# Altium project DATN_Project.PrjPcb
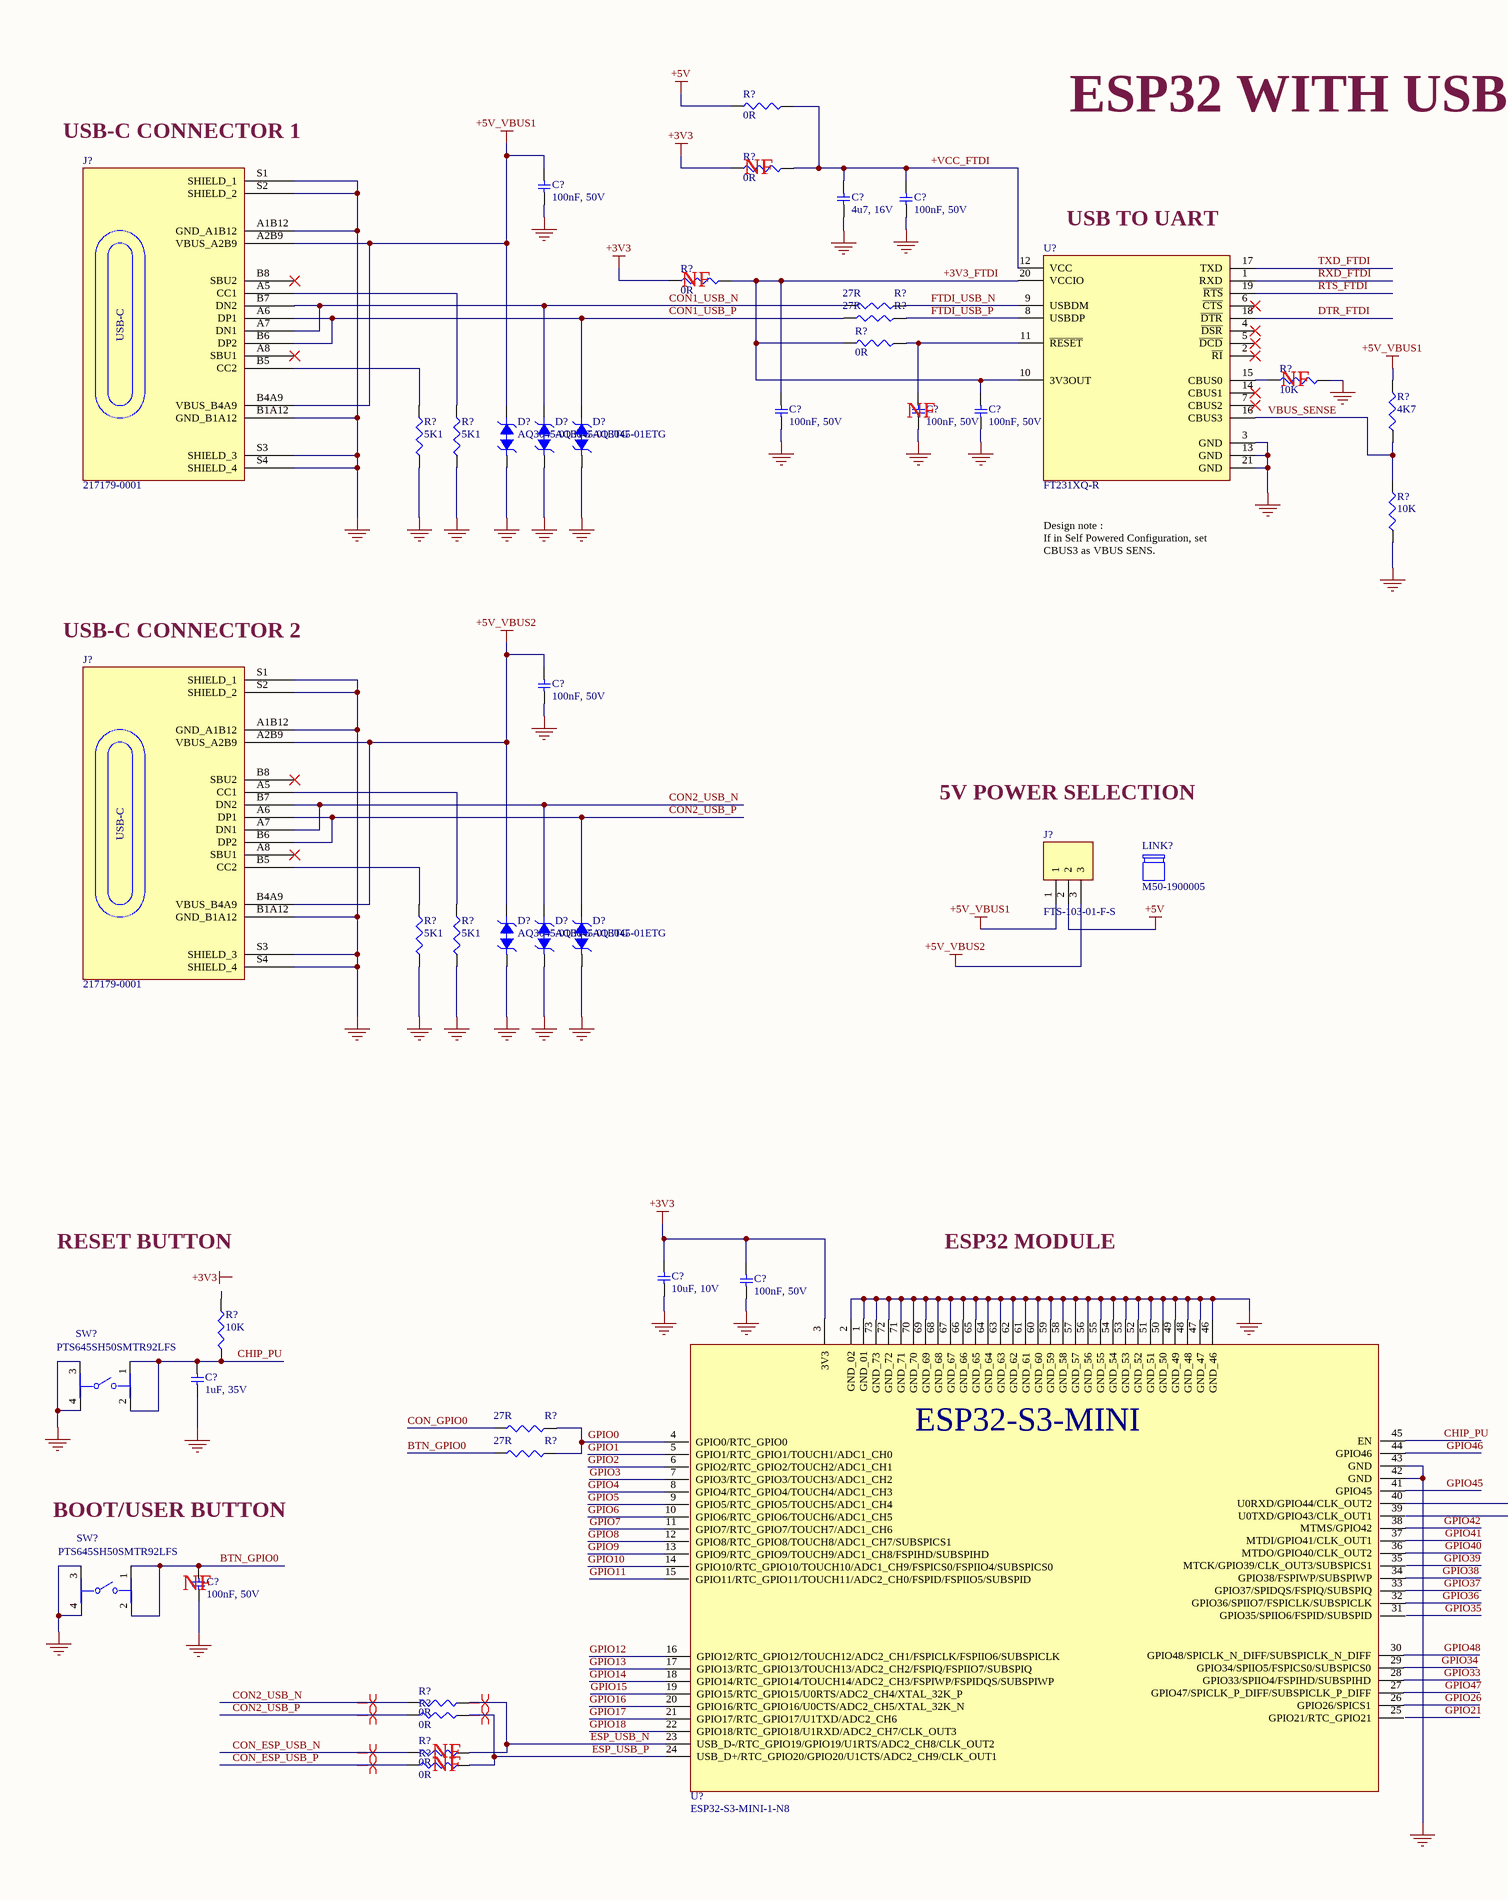
[diagram p0: ESP32.SchDoc, left]
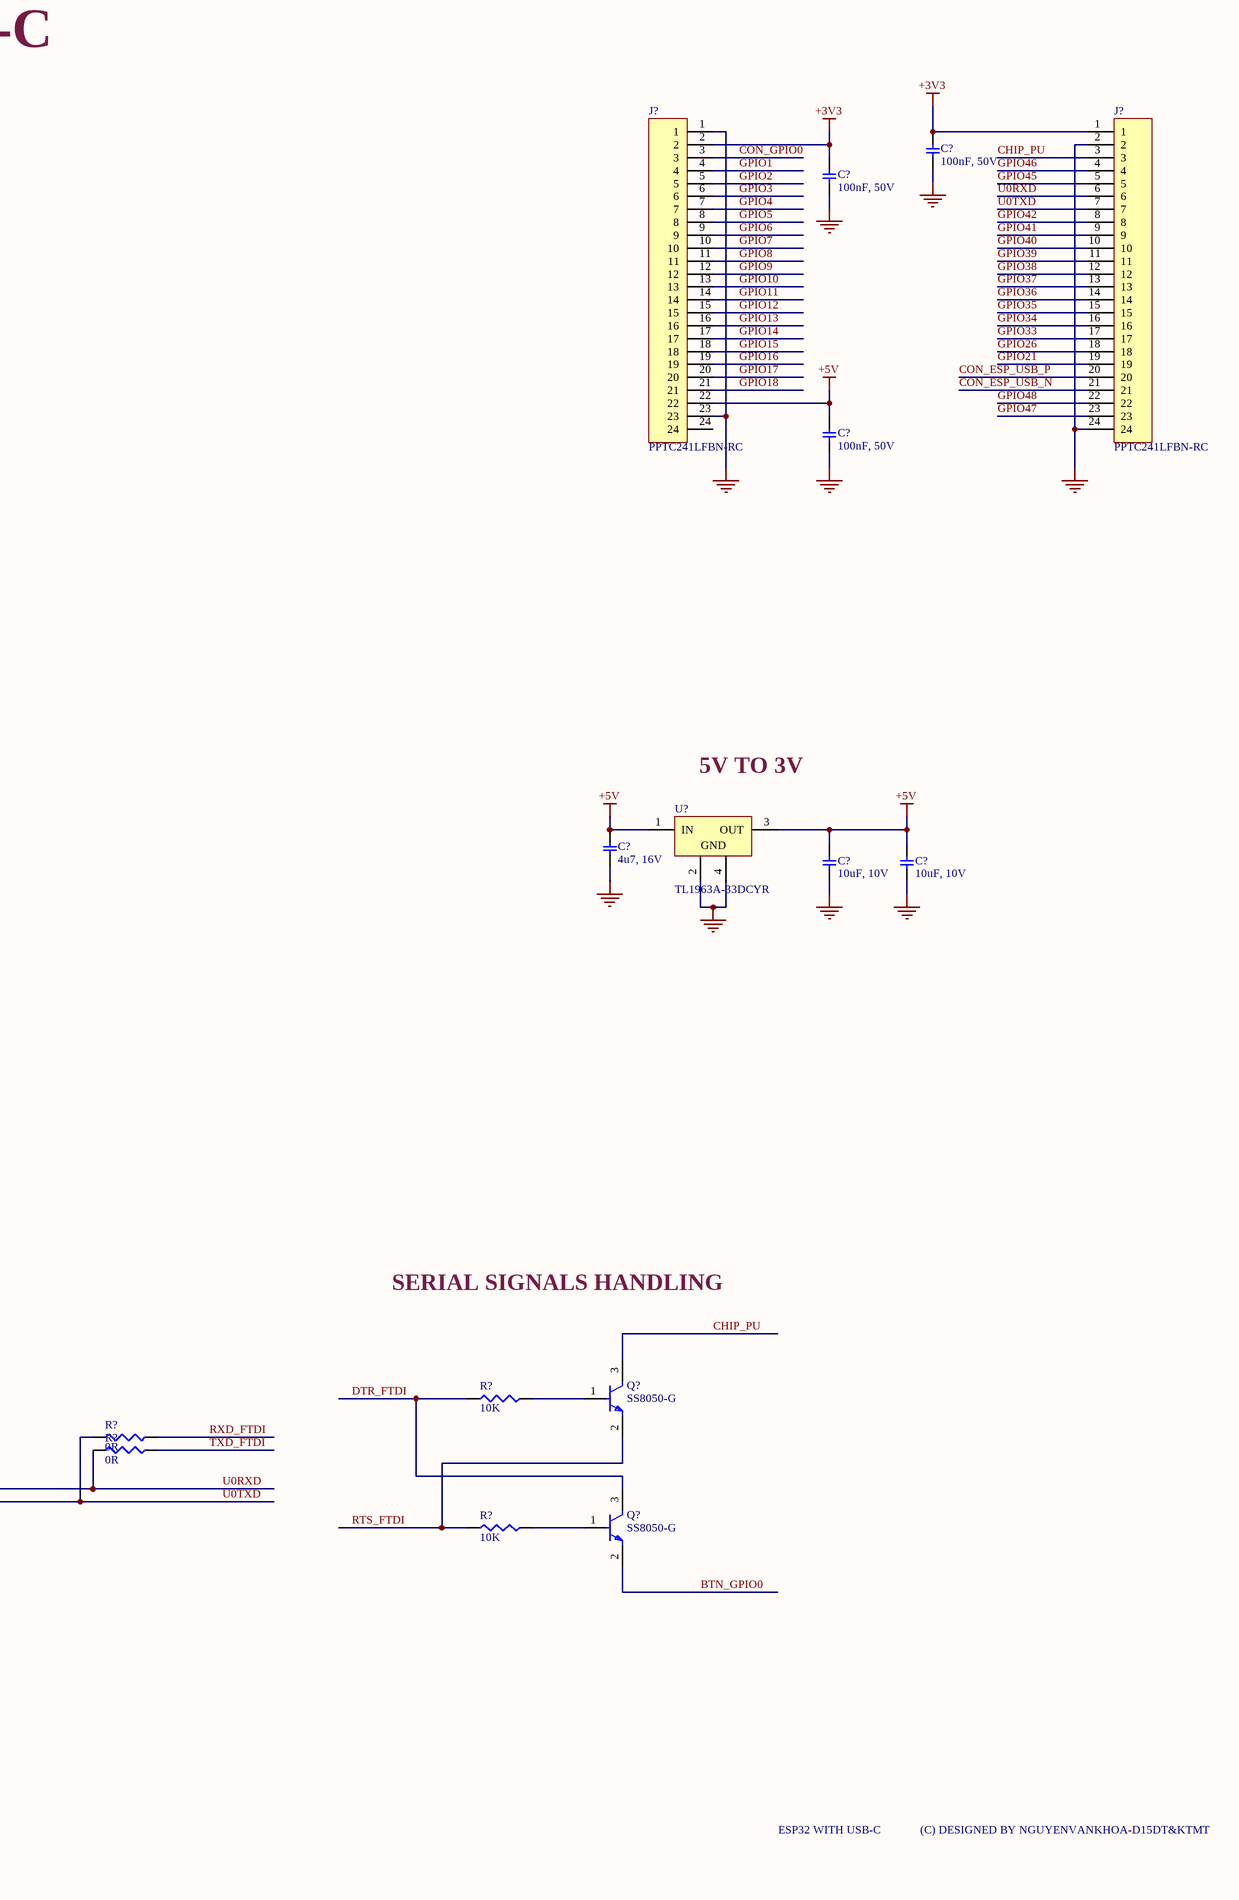
[diagram p1: ESP32.SchDoc, right]
1 sheet, 60 parts. Net scope: global (net labels, ports and power ports of the same name join across sheets).
Board file: ESP_PCB.PcbDoc

## Sheet ESP32.SchDoc
size 566 x 398 mm; Organization: ORGANIZATION; Address1: ADDRESS 1; Address2: ADDRESS 2; Address3: ADDRESS 3; Address4: ADDRESS 4; Revision: -; SheetNumber: 1; SheetTotal: 1; ENG_APP_DATE: --/--/--; DSN_APP_DATE: --/--/--; CHK_APP_DATE: --/--/--

### Parts
(Parts that share a designator on the sheet are numbered #1, #2 ... from top to bottom, then left to right.)
C?#1  4u7, 16V
C?#2  100nF, 50V
C?#3  100nF, 50V
C?#4  100nF, 50V
C?#5  100nF, 50V
C?#6  100nF, 50V
C?#7  100nF, 50V
C?#8  100nF, 50V
C?#9  100nF, 50V
C?#10  100nF, 50V
C?#11  4u7, 16V
C?#12  10uF, 10V
C?#13  10uF, 10V
C?#14  10uF, 10V
C?#15  100nF, 50V
C?#16  1uF, 35V
C?#17  100nF, 50V
D?#1  AQ3045-01ETG
D?#2  AQ3045-01ETG
D?#3  AQ3045-01ETG
D?#4  AQ3045-01ETG
D?#5  AQ3045-01ETG
D?#6  AQ3045-01ETG
J?#1  PPTC241LFBN-RC
J?#2  PPTC241LFBN-RC
J?#3  217179-0001
J?#4  217179-0001
J?#5  FTS-103-01-F-S
LINK?  M50-1900005
Q?#1  SS8050-G
Q?#2  SS8050-G
R?#1  0R
R?#2  0R
R?#3  0R
R?#4  27R
R?#5  27R
R?#6  0R
R?#7  10K
R?#8  4K7
R?#9  5K1
R?#10  5K1
R?#11  10K
R?#12  5K1
R?#13  5K1
R?#14  10K
R?#15  10K
R?#16  27R
R?#17  27R
R?#18  0R
R?#19  0R
R?#20  10K
R?#21  0R
R?#22  0R
R?#23  0R
R?#24  0R
SW?#1  PTS645SH50SMTR92LFS
SW?#2  PTS645SH50SMTR92LFS
U?#1  FT231XQ-R
U?#2  TL1963A-33DCYR
U?#3  ESP32-S3-MINI-1-N8

### Nets
+3V3: C?#4.2 C?#5.2 C?#14.2 C?#15.2 J?#1.2 J?#2.1 R?#2.1 R?#3.1 U?#3.3(3V3)
+5V: C?#9.2 C?#11.1 C?#12.2 C?#13.2 J?#1.22 J?#5.2 R?#1.1 U?#2.1(IN) U?#2.3(OUT)
+5V_VBUS1: C?#2.2 D?#2.2 J?#3.A2B9(VBUS_A2B9) J?#3.B4A9(VBUS_B4A9) J?#5.1 R?#8.2
+5V_VBUS2: C?#10.2 D?#5.2 J?#4.A2B9(VBUS_A2B9) J?#4.B4A9(VBUS_B4A9) J?#5.3
GND: C?#1.2 C?#2.1 C?#3.1 C?#4.1 C?#5.1 C?#6.1 C?#7.1 C?#8.1 C?#9.1 C?#10.1 C?#11.2 C?#12.1 C?#13.1 C?#14.1 C?#15.1 C?#16.1 C?#17.1 D?#1.1 D?#2.1 D?#3.1 D?#4.1 D?#5.1 D?#6.1 J?#1.1 J?#1.23 J?#2.2 J?#2.24 J?#3.A1B12(GND_A1B12) J?#3.B1A12(GND_B1A12) J?#3.S1(SHIELD_1) J?#3.S2(SHIELD_2) J?#3.S3(SHIELD_3) J?#3.S4(SHIELD_4) J?#4.A1B12(GND_A1B12) J?#4.B1A12(GND_B1A12) J?#4.S1(SHIELD_1) J?#4.S2(SHIELD_2) J?#4.S3(SHIELD_3) J?#4.S4(SHIELD_4) R?#7.2 R?#9.1 R?#10.1 R?#11.1 R?#12.1 R?#13.1 SW?#1.3 SW?#1.4 SW?#2.3 SW?#2.4 U?#1.3(GND) U?#1.13(GND) U?#1.21(GND) U?#2.2(GND) U?#2.4(GND) U?#3.1(GND_01) U?#3.2(GND_02) U?#3.42(GND) U?#3.43(GND) U?#3.46(GND_46) U?#3.47(GND_47) U?#3.48(GND_48) U?#3.49(GND_49) U?#3.50(GND_50) U?#3.51(GND_51) U?#3.52(GND_52) U?#3.53(GND_53) U?#3.54(GND_54) U?#3.55(GND_55) U?#3.56(GND_56) U?#3.57(GND_57) U?#3.58(GND_58) U?#3.59(GND_59) U?#3.60(GND_60) U?#3.61(GND_61) U?#3.62(GND_62) U?#3.63(GND_63) U?#3.64(GND_64) U?#3.65(GND_65) U?#3.66(GND_66) U?#3.67(GND_67) U?#3.68(GND_68) U?#3.69(GND_69) U?#3.70(GND_70) U?#3.71(GND_71) U?#3.72(GND_72) U?#3.73(GND_73)
+3V3_FTDI: C?#6.2 C?#8.2 R?#3.2 R?#6.1 U?#1.10(3V3OUT) U?#1.20(VCCIO)
+VCC_FTDI: C?#1.1 C?#3.2 R?#1.2 R?#2.2 U?#1.12(VCC)
BTN_GPIO0: C?#17.2 Q?#2.2(E) R?#17.1 SW?#2.1 SW?#2.2
CHIP_PU: C?#16.2 J?#2.3 Q?#1.3(C) R?#14.1 SW?#1.1 SW?#1.2 U?#3.45(EN)
CON1_USB_N: D?#3.2 J?#3.A7(DN1) J?#3.B7(DN2) R?#4.1
CON1_USB_P: D?#1.2 J?#3.A6(DP1) J?#3.B6(DP2) R?#5.1
CON2_USB_N: D?#6.2 J?#4.A7(DN1) J?#4.B7(DN2) R?#21.1
CON2_USB_P: D?#4.2 J?#4.A6(DP1) J?#4.B6(DP2) R?#22.1
CON_ESP_USB_N: J?#2.21 R?#23.1
CON_ESP_USB_P: J?#2.20 R?#24.1
CON_GPIO0: J?#1.3 R?#16.1
DTR_FTDI: Q?#2.3(C) R?#15.2 U?#1.18(~{DTR})
ESP_USB_N: R?#21.2 R?#23.2 U?#3.23(USB_D-/RTC_GPIO19/GPIO19/U1RTS/ADC2_CH8/CLK_OUT2)
ESP_USB_P: R?#22.2 R?#24.2 U?#3.24(USB_D+/RTC_GPIO20/GPIO20/U1CTS/ADC2_CH9/CLK_OUT1)
FTDI_USB_N: R?#4.2 U?#1.9(USBDM)
FTDI_USB_P: R?#5.2 U?#1.8(USBDP)
GPIO0: R?#16.2 R?#17.2 U?#3.4(GPIO0/RTC_GPIO0)
GPIO1: J?#1.4 U?#3.5(GPIO1/RTC_GPIO1/TOUCH1/ADC1_CH0)
GPIO2: J?#1.5 U?#3.6(GPIO2/RTC_GPIO2/TOUCH2/ADC1_CH1)
GPIO3: J?#1.6 U?#3.7(GPIO3/RTC_GPIO3/TOUCH3/ADC1_CH2)
GPIO4: J?#1.7 U?#3.8(GPIO4/RTC_GPIO4/TOUCH4/ADC1_CH3)
GPIO5: J?#1.8 U?#3.9(GPIO5/RTC_GPIO5/TOUCH5/ADC1_CH4)
GPIO6: J?#1.9 U?#3.10(GPIO6/RTC_GPIO6/TOUCH6/ADC1_CH5)
GPIO7: J?#1.10 U?#3.11(GPIO7/RTC_GPIO7/TOUCH7/ADC1_CH6)
GPIO8: J?#1.11 U?#3.12(GPIO8/RTC_GPIO8/TOUCH8/ADC1_CH7/SUBSPICS1)
GPIO9: J?#1.12 U?#3.13(GPIO9/RTC_GPIO9/TOUCH9/ADC1_CH8/FSPIHD/SUBSPIHD)
GPIO10: J?#1.13 U?#3.14(GPIO10/RTC_GPIO10/TOUCH10/ADC1_CH9/FSPICS0/FSPIIO4/SUBSPICS0)
GPIO11: J?#1.14 U?#3.15(GPIO11/RTC_GPIO11/TOUCH11/ADC2_CH0/FSPID/FSPIIO5/SUBSPID)
GPIO12: J?#1.15 U?#3.16(GPIO12/RTC_GPIO12/TOUCH12/ADC2_CH1/FSPICLK/FSPIIO6/SUBSPICLK)
GPIO13: J?#1.16 U?#3.17(GPIO13/RTC_GPIO13/TOUCH13/ADC2_CH2/FSPIQ/FSPIIO7/SUBSPIQ)
GPIO14: J?#1.17 U?#3.18(GPIO14/RTC_GPIO14/TOUCH14/ADC2_CH3/FSPIWP/FSPIDQS/SUBSPIWP)
GPIO15: J?#1.18 U?#3.19(GPIO15/RTC_GPIO15/U0RTS/ADC2_CH4/XTAL_32K_P)
GPIO16: J?#1.19 U?#3.20(GPIO16/RTC_GPIO16/U0CTS/ADC2_CH5/XTAL_32K_N)
GPIO17: J?#1.20 U?#3.21(GPIO17/RTC_GPIO17/U1TXD/ADC2_CH6)
GPIO18: J?#1.21 U?#3.22(GPIO18/RTC_GPIO18/U1RXD/ADC2_CH7/CLK_OUT3)
GPIO21: J?#2.19
GPIO26: J?#2.18 U?#3.26(GPIO26/SPICS1)
GPIO33: J?#2.17 U?#3.28(GPIO33/SPIIO4/FSPIHD/SUBSPIHD)
GPIO34: J?#2.16 U?#3.29(GPIO34/SPIIO5/FSPICS0/SUBSPICS0)
GPIO35: J?#2.15
GPIO36: J?#2.14 U?#3.32(GPIO36/SPIIO7/FSPICLK/SUBSPICLK)
GPIO37: J?#2.13 U?#3.33(GPIO37/SPIDQS/FSPIQ/SUBSPIQ)
GPIO38: J?#2.12 U?#3.34(GPIO38/FSPIWP/SUBSPIWP)
GPIO39: J?#2.11
GPIO40: J?#2.10 U?#3.36(MTDO/GPIO40/CLK_OUT2)
GPIO41: J?#2.9 U?#3.37(MTDI/GPIO41/CLK_OUT1)
GPIO42: J?#2.8 U?#3.38(MTMS/GPIO42)
GPIO45: J?#2.5 U?#3.41(GPIO45)
GPIO46: J?#2.4 U?#3.44(GPIO46)
GPIO47: J?#2.23 U?#3.27(GPIO47/SPICLK_P_DIFF/SUBSPICLK_P_DIFF)
GPIO48: J?#2.22 U?#3.30(GPIO48/SPICLK_N_DIFF/SUBSPICLK_N_DIFF)
RTS_FTDI: Q?#1.2(E) R?#20.2 U?#1.19(~{RTS})
RXD_FTDI: R?#18.2 U?#1.1(RXD)
TXD_FTDI: R?#19.2 U?#1.17(TXD)
U0RXD: J?#2.6 R?#19.1 U?#3.40(U0RXD/GPIO44/CLK_OUT2)
U0TXD: J?#2.7 R?#18.1
VBUS_SENSE: R?#8.1 R?#11.2 U?#1.16(CBUS3)
NetC?#7_2: C?#7.2 R?#6.2 U?#1.11(~{RESET})
NetJ?#3_A5: J?#3.A5(CC1) R?#10.2
NetJ?#3_B5: J?#3.B5(CC2) R?#9.2
NetJ?#4_A5: J?#4.A5(CC1) R?#13.2
NetJ?#4_B5: J?#4.B5(CC2) R?#12.2
NetQ?#1_1: Q?#1.1(B) R?#15.1
NetQ?#2_1: Q?#2.1(B) R?#20.1
NetR?#7_1: R?#7.1 U?#1.15(CBUS0)

Not connected (* = marked no-connect by the designer): J?#1 24; J?#3 A8(SBU1)* B8(SBU2)*; J?#4 A8(SBU1)* B8(SBU2)*; R?#14 2; U?#1 2(~{RI})* 4(~{DSR})* 5(~{DCD})* 6(~{CTS})* 7(CBUS2)* 14(CBUS1)*; U?#3 25(GPIO21/RTC_GPIO21) 31(GPIO35/SPIIO6/FSPID/SUBSPID) 35(MTCK/GPIO39/CLK_OUT3/SUBSPICS1) 39(U0TXD/GPIO43/CLK_OUT1)

### Layout directives
differential pair; differential pair class DIFF90: CON2_USB_N, CON2_USB_P, CON_ESP_USB_N, CON_ESP_USB_P, ESP_USB_N, ESP_USB_P

### Notes on the sheet
- ESP32 WITH USB-C
- (near J?#3) USB-C CONNECTOR 1
- (near R?#2) NF
- (near U?#1) USB TO UART
- (near R?#3) NF
- (near R?#7) NF
- (near C?#7) NF
- Design note :
  If in Self Powered Configuration, set CBUS3 as VBUS SENS.
- (near J?#4) USB-C CONNECTOR 2
- 5V POWER SELECTION
- 5V TO 3V
- RESET BUTTON
- ESP32 MODULE
- SERIAL SIGNALS HANDLING
- BOOT/USER BUTTON
- (near C?#17) NF
- (near R?#23) NF
- (C) DESIGNED BY NGUYENVANKHOA-D15DT&KTMT
- Labels drawn without touching a wire or pin: +3V3
- DWG. NO.
- REV.
- SHT.
- THIS DOCUMENT AND THE DATA DISCLOSED HEREIN OR HEREWITH IS THE PROPERTY OF ALTIUM LIMITED AND MAY BE FREELY DISTRIBUTED IN WHOLE. NO RIGHTS ARE RESERVED OR EXPRESS OR IMPLIED WARANTEE GIVEN.
- REVISION
- DESCRIPTION
- DATE
- APPROVED
- ENG:
- APPROVALS
- PROJECT
- DSN:
- CHK:
- REFERENCE DOCUMENTS
- PROJECT REVISION:
- TITLE
- DOCUMENT REVISION:
- DESIGN ITEM:
- BOM:
- FAB DWG:
- PCB DWG:
- ASSY DWG:
- SCALE:
- SIZE
- B
- CAGE CODE
- FILE NAME
- DWG NO.
- SHEET
- OF
- REV
- (in symbol 217179-0001) USB-C
- (in symbol ESP32-S3-MINI-1-N8) ESP32-S3-MINI

### Library data of the parts
C?#1 C?#11 = CL05A475MO5NUNC: CAP CER 4.7UF 16V X5R 0402; Manufacturer: Samsung; Material: 4241ConductorMaterial; Tolerance: 20%; Supplier 1: Digikey; Manufacturer Part Number: CL05A475MO5NUNC; RoHS: Yes; Category: Ceramic Capacitors; Stock 1: 242612; Pricing 1: 1=0.45, 10=0.268, 50=0.1948, 100=0.1721, 500=0.1333, 1000=0.12121, 2500=0.10837, 5000=0.10058 (USD); Mount: Surface Mount; Case/Package: 0402; Case Code (Metric): 1005; Case Code (Imperial): 0402; Min Operating Temperature: -55°C; Max Operating Temperature: 85°C; Packaging: Cut Tape; Capacitance: 4.7uF; Voltage Rating: 16V; Series: CL; Voltage Rating (DC): 16V; Length: 0.039inch; Width: 0.02inch; Height: 550um; Thickness: 0.022inch; RoHS Compliant: Yes; ComponentLink1URL: http://www.farnell.com/datasheets/2710653.pdf?src-supplier=Farnell; ComponentLink1Description: http://www.farnell.com/datasheets/2710653.pdf?src-supplier=Farnell; ComponentLink2URL: http://www.samsungsem.com/kr/support/product-search/mlcc/CL05A475MO5NUNC.jsp?src-supplier=Digikey; ComponentLink2Description: http://www.samsungsem.com/kr/support/product-search/mlcc/CL05A475MO5NUNC.jsp?src-supplier=Digikey; ComponentLink3URL: http://www.farnell.com/datasheets/2710653.pdf?src-supplier=Element14; ComponentLink3Description: http://www.farnell.com/datasheets/2710653.pdf?src-supplier=Element14; ComponentLink4URL: https://datasheet.octopart.com/CL05A475MO5NUNC-Samsung-Electro-Mechanics-datasheet-123102911.pdf?src-supplier=Future+Electronics; ComponentLink4Description: https://datasheet.octopart.com/CL05A475MO5NUNC-Samsung-Electro-Mechanics-datasheet-123102911.pdf?src-supplier=Future+Electronics; ComponentLink5URL: http://www.farnell.com/datasheets/2710653.pdf?src-supplier=Newark; ComponentLink5Description: http://www.farnell.com/datasheets/2710653.pdf?src-supplier=Newark; Supplier Part Number 1: 1276-6836-1-ND; LCSC Part Number: C318563
C?#2-C?#10 C?#15 C?#17 = CL05B104KB54PNC: CAP CER 0.1UF 50V X7R 0402; Manufacturer: Samsung; Material: 4241ConductorMaterial; Tolerance: 10%; Supplier 1: Digikey; Manufacturer Part Number: CL05B104KB54PNC; RoHS: Yes; Category: Ceramic Capacitors; Stock 1: 607949; Pricing 1: 1=0.1, 10=0.036, 50=0.0246, 100=0.0211, 500=0.01508, 1000=0.0132, 2500=0.01122, 5000=0.01002 (USD); Case/Package: 343Case; Min Operating Temperature: -55°C; Max Operating Temperature: 125°C; Voltage Rating: 50V; Capacitance: 100nF; Height: 550um; RoHS Compliant: Yes; ComponentLink1URL: https://datasheet.octopart.com/CL05B104KB54PNC-Samsung-datasheet-8326407.pdf?src-supplier=TME; ComponentLink1Description: https://datasheet.octopart.com/CL05B104KB54PNC-Samsung-datasheet-8326407.pdf?src-supplier=TME; Supplier Part Number 1: 1276-CL05B104KB54PNCCT-ND; LCSC Part Number: C307331
C?#12-C?#14 = CL05A106MP8NUB8: CAP CER 10UF 10V X5R 0402; Manufacturer: Samsung; Material: Ceramic; Tolerance: 20%; Supplier 1: Digikey; Manufacturer Part Number: CL05A106MP8NUB8; RoHS: Yes; Category: Ceramic Capacitors; Stock 1: 965097; Pricing 1: 1=0.33, 10=0.215, 50=0.1584, 100=0.129, 500=0.1018, 1000=0.08597, 2500=0.08145, 8000=0.0724, 16000=0.07013, 24000=0.06787, 56000=0.06335 (USD); Mount: Surface Mount; Case/Package: 0402; Case Code (Metric): 1005; Case Code (Imperial): 0402; Min Operating Temperature: -55°C; Max Operating Temperature: 85°C; Packaging: Cut Tape; Capacitance: 10uF; Voltage Rating: 10V; Series: CL; Length: 0.039inch; Width: 0.02inch; Height: 550um; Thickness: 0.035inch; RoHS Compliant: Yes; ComponentLink1URL: http://www.samsungsem.com/kr/support/product-search/mlcc/CL05A106MP8NUB8.jsp?src-supplier=Digikey; ComponentLink1Description: http://www.samsungsem.com/kr/support/product-search/mlcc/CL05A106MP8NUB8.jsp?src-supplier=Digikey; ComponentLink2URL: https://datasheet.octopart.com/CL05A106MP8NUB8-Samsung-Electro-Mechanics-datasheet-136460857.pdf?src-supplier=Future+Electronics; ComponentLink2Description: https://datasheet.octopart.com/CL05A106MP8NUB8-Samsung-Electro-Mechanics-datasheet-136460857.pdf?src-supplier=Future+Electronics; Supplier Part Number 1: 1276-6830-1-ND; LCSC Part Number: C307415
C?#16 = CL05A105KL5NRNC: CAP CER 1UF 35V X5R 0402; Manufacturer: Samsung; Tolerance: 10%; Supplier 1: Digikey; Manufacturer Part Number: CL05A105KL5NRNC; RoHS: Yes; Category: Ceramic Capacitors; Stock 1: 314483; Pricing 1: 1=0.33, 10=0.212, 50=0.149, 100=0.1202, 500=0.08934, 1000=0.07818, 2500=0.07446, 5000=0.06887 (USD); Mount: Surface Mount; Case/Package: 0402; Case Code (Metric): 1005; Case Code (Imperial): 0402; Min Operating Temperature: -55°C; Max Operating Temperature: 85°C; Packaging: Cut Tape; Capacitance: 1uF; Voltage Rating: 35V; Series: CL; Length: 0.039inch; Width: 0.02inch; Thickness: 0.022inch; RoHS Compliant: Yes; ComponentLink1URL: http://www.samsungsem.com/kr/support/product-search/mlcc/CL05A105KL5NRNC.jsp?src-supplier=Digikey; ComponentLink1Description: http://www.samsungsem.com/kr/support/product-search/mlcc/CL05A105KL5NRNC.jsp?src-supplier=Digikey; Supplier Part Number 1: 1276-6796-1-ND; LCSC Part Number: C307413
D?#1-D?#6 = AQ3045-01ETG: TVS DIODE 5.3VWM 12VC SOD882; Manufacturer: Littelfuse; Number of Bidirectional Channels: 1; Reverse Standoff Voltage: 5.3V; Min Breakdown Voltage: 6.8V; Peak Pulse Current: 3A; Peak Pulse Power: 40W; Power Line Protection: No; Diode Type: ZENER; Leakage Current: 100nA; Supplier 1: Digikey; Manufacturer Part Number: AQ3045-01ETG; RoHS: Yes; Category: TVS Diodes; Stock 1: 11003; Pricing 1: 1=0.5, 10=0.391, 100=0.2344, 500=0.217, 1000=0.14756, 2000=0.13585, 5000=0.1302 (USD); Mount: Surface Mount; Min Operating Temperature: -55°C; Max Operating Temperature: 150°C; Packaging: Cut Tape; Series: Automotive, AEC-Q101, AQ3045, SPA®; Number of Channels: 1; Operating Supply Voltage: 5.3V; RoHS Compliant: Yes; ComponentLink1URL: http://www.littelfuse.com/~/media/electronics/datasheets/tvs_diode_arrays/littelfuse_tvs_diode_array_aq3045_datasheet.pdf.pdf?src-supplier=Digikey; ComponentLink1Description: http://www.littelfuse.com/~/media/electronics/datasheets/tvs_diode_arrays/littelfuse_tvs_diode_array_aq3045_datasheet.pdf.pdf?src-supplier=Digikey; ComponentLink2URL: https://www.littelfuse.com/~/media/electronics/datasheets/tvs_diode_arrays/littelfuse_tvs_diode_array_aq3045_datasheet.pdf.pdf?src-supplier=Digikey; ComponentLink2Description: https://www.littelfuse.com/~/media/electronics/datasheets/tvs_diode_arrays/littelfuse_tvs_diode_array_aq3045_datasheet.pdf.pdf?src-supplier=Digikey; ComponentLink3URL: https://datasheet.octopart.com/AQ3045-01ETG-Littelfuse-datasheet-101609968.pdf?src-supplier=Farnell; ComponentLink3Description: https://datasheet.octopart.com/AQ3045-01ETG-Littelfuse-datasheet-101609968.pdf?src-supplier=Farnell; ComponentLink4URL: https://datasheet.octopart.com/AQ3045-01ETG-Littelfuse-datasheet-140480283.pdf?src-supplier=Future+Electronics; ComponentLink4Description: https://datasheet.octopart.com/AQ3045-01ETG-Littelfuse-datasheet-140480283.pdf?src-supplier=Future+Electronics; Supplier Part Number 1: F9321CT-ND; LCSC Part Number: C3710326
J?#1 J?#2 = PPTC241LFBN-RC: CONN HDR 24POS 0.1 TIN PCB; Manufacturer: Sullins; Number of Positions: 24; Connector Type: Header; Voltage Rating: 250V; Supplier 1: Digikey; Manufacturer Part Number: PPTC241LFBN-RC; RoHS: Yes; Category: Connectors; Stock 1: 10961; Pricing 1: 1=1.39, 10=1.206, 80=1.07775, 440=0.89816, 1000=0.76986, 5000=0.7332 (USD); Mount: Through Hole; Contact Material: Bronze; Housing Material: Plastic; Contact Finish - Mating: TIN; Insulation Color: Black; Insulation Material: Polyester; Contact Shape: Square; Min Operating Temperature: -40°C; Max Operating Temperature: 105°C; Number of Rows: 1; Packaging: Tray; Termination: Solder; Contact Type: Female Socket; Series: -; Fastening Type: Pull; Length: 61.5mm; Width: 2.5mm; Height: 8.5mm; Lead Free: Lead Free; RoHS Compliant: Yes; Flammability Rating: UL94 V-0; ComponentLink1URL: https://drawings-pdf.s3.amazonaws.com/10492.pdf?src-supplier=Digikey; ComponentLink1Description: https://drawings-pdf.s3.amazonaws.com/10492.pdf?src-supplier=Digikey; ComponentLink2URL: https://datasheet.octopart.com/PPTC241LFBN-RC-Sullins-datasheet-145015166.pdf?src-supplier=Future+Electronics; ComponentLink2Description: https://datasheet.octopart.com/PPTC241LFBN-RC-Sullins-datasheet-145015166.pdf?src-supplier=Future+Electronics; Supplier Part Number 1: S7022-ND; LCSC Part Number: C7328152
J?#3 J?#4 = 217179-0001: CONN RCP USB2.0 TYP C 24P SMD RA; Manufacturer: Molex; USB Standard: 6108USBStandard; Current Rating: 1.25A; Gender: 4472Gender; Number of Contacts: 16NUMBER; Voltage Rating: 30V; Supplier 1: Digikey; Manufacturer Part Number: 217179-0001; RoHS: No; Category: USB Connectors; Pricing 1: 1=0.9, 10=0.745, 100=0.6212 (USD); Contact Material: 153,157ConductorMaterial; Min Operating Temperature: -40°C; Max Operating Temperature: 85°C; Height: 3.36mm; Supplier Part Number 1: 900-2171790001CT-ND; LCSC Part Number: C3197684
J?#5 = FTS-103-01-F-S: CONN HEADER VERT 3POS 1.27MM; Manufacturer: Samtec; Number of Contacts: 3; Gender: Male; Supplier 1: Digikey; Manufacturer Part Number: FTS-103-01-F-S; RoHS: Yes; Category: Connectors; Stock 1: 3030; Pricing 1: 1=0.73, 50=0.6378, 100=0.5407, 500=0.4491, 1000=0.4 (USD); Mount: Through Hole; Contact Plating: Gold; Number of Rows: 1; Packaging: Bulk; Termination: Solder; Pitch: 1.27mm; Radiation Hardening: No; RoHS Compliant: Yes; ComponentLink1URL: http://suddendocs.samtec.com/prints/fts-1xx-xx-xx-xx-xx-mkt.pdf?src-supplier=Digikey; ComponentLink1Description: http://suddendocs.samtec.com/prints/fts-1xx-xx-xx-xx-xx-mkt.pdf?src-supplier=Digikey; ComponentLink2URL: http://www.samtec.com/documents/webfiles/pdf/FTS.pdf?src-supplier=Avnet; ComponentLink2Description: http://www.samtec.com/documents/webfiles/pdf/FTS.pdf?src-supplier=Avnet; ComponentLink3URL: https://datasheet.octopart.com/FTS-103-01-F-S-Samtec-datasheet-176663378.pdf?src-supplier=Toby+Electronics; ComponentLink3Description: https://datasheet.octopart.com/FTS-103-01-F-S-Samtec-datasheet-176663378.pdf?src-supplier=Toby+Electronics; ComponentLink4URL: https://datasheet.octopart.com/FTS-103-01-F-S-Samtec-datasheet-151470456.pdf?src-supplier=Sager+Electronics; ComponentLink4Description: https://datasheet.octopart.com/FTS-103-01-F-S-Samtec-datasheet-151470456.pdf?src-supplier=Sager+Electronics; Supplier Part Number 1: 612-FTS-103-01-F-S-ND; LCSC Part Number: C3333578
LINK? = M50-1900005: CONN SHUNT 1.27MM BLACK; Manufacturer: Harwin; Number of Positions: 2; Number of Contacts: 3; Current Rating: 1A; Voltage Rating: 500V; Insulation Resistance: 1R; Supplier 1: Digikey; Manufacturer Part Number: M50-1900005; RoHS: Yes; Category: Headers and Wire Housings; Stock 1: 33850; Pricing 1: 1=0.43, 10=0.363, 25=0.3196, 50=0.2936, 100=0.2821, 250=0.25332, 500=0.2418, 1000=0.2015, 3000=0.18422 (USD); Contact Material: Copper Alloy; Contact Plating: Gold; Color: Black; Housing Material: PBT; Housing Color: Black; Min Operating Temperature: -40°C; Max Operating Temperature: 105°C; Number of Rows: 1; Packaging: Bulk; Series: Archer M50; Package Quantity: 1000; Pitch: 1.27mm; Radiation Hardening: No; RoHS Compliant: Yes; Reach SVHC Compliant: No; Flammability Rating: UL94 V-0; ComponentLink1URL: https://datasheet.ciiva.com/767/m50-19x-767925.pdf?src-supplier=Digikey; ComponentLink1Description: https://datasheet.ciiva.com/767/m50-19x-767925.pdf?src-supplier=Digikey; ComponentLink2URL: https://datasheet.ciiva.com/1412/1836978-1412124.pdf?src-supplier=Element14; ComponentLink2Description: https://datasheet.ciiva.com/1412/1836978-1412124.pdf?src-supplier=Element14; Supplier Part Number 1: 952-1730-ND; LCSC Part Number: C6293276
Q?#1 Q?#2 = SS8050-G: TRANS NPN 25V 1.5A SOT23-3; Manufacturer: Comchip; Max Power Dissipation: 300mW; Transition Frequency: 100MHz; Collector-emitter Voltage-Max: 400mV; Collector Base Voltage (VCBO): 40V; Collector Emitter Saturation Voltage: 500mV; Emitter Base Voltage (VEBO): 5V; hFE Min: 200; Number of Elements: 1; Supplier 1: Digikey; Manufacturer Part Number: SS8050-G; RoHS: Yes; Category: Transistors; Stock 1: 90298; Pricing 1: 1=0.29, 10=0.2, 100=0.0978, 500=0.08154, 1000=0.05666 (USD); Mount: Surface Mount; Case/Package: TO-236-3; Max Operating Temperature: 150°C; Packaging: Cut Tape; Max Collector Current: 1.5A; Collector Emitter Breakdown Voltage: 25V; Max Breakdown Voltage: 25V; Series: -; Power Dissipation: 300mW; Height: 1.15mm; RoHS Compliant: Yes; ComponentLink1URL: http://www.comchiptech.com/admin/files/product/SS8050-G RevA181526.pdf?src-supplier=Digikey; ComponentLink1Description: http://www.comchiptech.com/admin/files/product/SS8050-G RevA181526.pdf?src-supplier=Digikey; Supplier Part Number 1: 641-1790-1-ND; LCSC Part Number: C164886
R?#1-R?#3 R?#6 R?#18 R?#19 R?#21-R?#24 = RC0402JR-070RL: RES 0 OHM JUMPER 1/16W 0402; Manufacturer: Yageo; Resistance: 0mR; Power Rating: 62.5mW; Tolerance: 5%; Voltage Rating: 50V; Max Power Dissipation: 63mW; Temperature Coefficient: 200ppm/°C; Supplier 1: Digikey; Manufacturer Part Number: RC0402JR-070RL; RoHS: Yes; Category: Chip SMD Resistors; Stock 1: 14519977; Pricing 1: 1=0.1, 10=0.011, 25=0.0084, 50=0.0064, 100=0.0045, 250=0.00364, 500=0.0029, 1000=0.00214, 5000=0.00154, 10000=0.00133, 30000=0.00117, 50000=0.00107, 100000=0.00105 (USD); Case/Package: 0402; Contact Plating: Tin,Matte; Case Code (Metric): 1005; Case Code (Imperial): 0402; Size Code: 0402; Min Operating Temperature: -55°C; Max Operating Temperature: 155°C; Packaging: Tape and Reel; Resistor Type: Thick Film; Package Quantity: 1; Number of Terminations: 2; Termination: SMD/SMT; Features: Moisture Resistant; Series: RC; Technology: THICK FILM; Resistance Tolerance: 5%; Construction: Rectangular; Length: 1mm; Width: 0.02inch; Height: 0.016inch; Depth: 0.5mm; Reach SVHC Compliant: Unknown; Lead Free: 5697LeadFree; Military Standard: Not; RoHS Compliant: Yes; Supplier Part Number 1: 311-0.0JRCT-ND; LCSC Part Number: C60485
R?#4 R?#5 R?#16 R?#17 = RC0402FR-0727RL: RES 27 OHM 1% 1/16W 0402; Manufacturer: Yageo; Power Rating: 62.5mW; Voltage Rating: 50V; Temperature Coefficient: 100ppm/°C; Max Power Dissipation: 63mW; Supplier 1: Digikey; Manufacturer Part Number: RC0402FR-0727RL; RoHS: Yes; Category: Chip SMD Resistors; Stock 1: 217548; Pricing 1: 1=0.1, 10=0.015, 50=0.0088, 100=0.0073, 500=0.00488, 1000=0.00417, 5000=0.00297 (USD); Case/Package: 0402; Case Code (Imperial): 0402; Case Code (Metric): 1005; Weight: 2.3E-05oz; Size Code: 0402; Min Operating Temperature: -55°C; Max Operating Temperature: 155°C; Resistance: 27R; Tolerance: 1%; Packaging: Tape and Reel; Resistor Type: Thick Film; Termination: SMD/SMT; Number of Terminations: 2; Features: Moisture Resistant; Series: RC; Construction: Rectangular; Technology: THICK FILM; Resistance Tolerance: 1%; Voltage Rating (AC): 50V; Length: 1mm; Width: 0.5mm; Height: 0.016inch; Depth: 0.5mm; Military Standard: Not; Lead Free: Lead Free; RoHS Compliant: Yes; Reach SVHC Compliant: Unknown; ComponentLink1URL: https://datasheet.ciiva.com/11808/0900766b80c66297-11808450.pdf?src-supplier=Rs; ComponentLink1Description: https://datasheet.ciiva.com/11808/0900766b80c66297-11808450.pdf?src-supplier=Rs; ComponentLink2URL: https://datasheet.ciiva.com/17044/pyu-rc0402-51-rohs-l-6-17044345.pdf?src-supplier=Future+Electronics; ComponentLink2Description: https://datasheet.ciiva.com/17044/pyu-rc0402-51-rohs-l-6-17044345.pdf?src-supplier=Future+Electronics; ComponentLink3URL: https://datasheet.ciiva.com/15189/getdatasheetpartid-327852-15189402.pdf?src-supplier=Verical; ComponentLink3Description: https://datasheet.ciiva.com/15189/getdatasheetpartid-327852-15189402.pdf?src-supplier=Verical; ComponentLink4URL: https://datasheet.ciiva.com/7849/1018594-7849926.pdf?src-supplier=Element14; ComponentLink4Description: https://datasheet.ciiva.com/7849/1018594-7849926.pdf?src-supplier=Element14; ComponentLink5URL: https://datasheet.ciiva.com/7849/1018594-7849927.pdf?src-supplier=Element14; ComponentLink5Description: https://datasheet.ciiva.com/7849/1018594-7849927.pdf?src-supplier=Element14; Supplier Part Number 1: YAG3086CT-ND; LCSC Part Number: C138021
R?#7 R?#11 R?#14 R?#15 R?#20 = AC0402FR-0710KL: RES SMD 10K OHM 1% 1/16W 0402; Manufacturer: Yageo; Resistance: 10kR; Power Rating: 62.5mW; Voltage Rating: 50V; Temperature Coefficient: 100ppm/°C; Max Power Dissipation: 63mW; Supplier 1: Digikey; Manufacturer Part Number: AC0402FR-0710KL; RoHS: Yes; Category: Chip SMD Resistors; Stock 1: 2351184; Pricing 1: 1=0.1, 10=0.019, 50=0.0116, 100=0.0095, 500=0.00638, 1000=0.00544, 5000=0.00391 (USD); Case/Package: 0402; Case Code (Imperial): 0402; Case Code (Metric): 1005; Size Code: 0402; Min Operating Temperature: -55°C; Max Operating Temperature: 155°C; Tolerance: 1%; Packaging: Tape and Reel; Termination: SMD/SMT; Number of Terminations: 2; Features: Moisture Resistant,Automotive AEC-Q200; Series: AC; Length: 0.039inch; Width: 0.02inch; Height: 0.015inch; Lead Free: Lead Free; RoHS Compliant: Yes; ComponentLink1URL: https://datasheet.ciiva.com/12656/pyu-ac-51-rohs-l-2-12656634.pdf?src-supplier=Mouser; ComponentLink1Description: https://datasheet.ciiva.com/12656/pyu-ac-51-rohs-l-2-12656634.pdf?src-supplier=Mouser; Supplier Part Number 1: YAG3436DKR-ND; LCSC Part Number: C144807
R?#8 = RC0402FR-074K7L: RES 4.7K OHM 1% 1/16W 0402; Manufacturer: Yageo; Voltage Rating (DC): 50V; Power Rating: 62.5mW; Resistance: 4.7kR; Temperature Coefficient: 100ppm/°C; Max Power Dissipation: 63mW; Supplier 1: Digikey; Manufacturer Part Number: RC0402FR-074K7L; RoHS: Yes; Category: Chip SMD Resistors; Stock 1: 4963511; Pricing 1: 1=0.1, 10=0.015, 50=0.0088, 100=0.0073, 500=0.00488, 1000=0.00417, 5000=0.00297, 10000=0.00261, 20000=0.00231, 30000=0.00216, 50000=0.00199, 100000=0.00179 (USD); Case/Package: 0402; Number of Pins: 2; Case Code (Imperial): 0402; Case Code (Metric): 1005; Size Code: 0402; Min Operating Temperature: -55°C; Max Operating Temperature: 155°C; Tolerance: 1%; Voltage Rating: 50V; Packaging: Tape and Reel; Resistor Type: Thick Film; Termination: SMD/SMT; Features: Moisture Resistant; Series: RC; Number of Terminations: 2; Resistance Tolerance: 1%; Construction: Rectangular; Voltage Rating (AC): 50V; Length: 1mm; Width: 0.5mm; Depth: 0.5mm; Reach SVHC Compliant: No; Military Standard: Not; Lead Free: Lead Free; RoHS Compliant: Yes; ComponentLink1URL: https://datasheet.ciiva.com/22661/1686128-22661342.pdf?src-supplier=Element14; ComponentLink1Description: https://datasheet.ciiva.com/22661/1686128-22661342.pdf?src-supplier=Element14; ComponentLink2URL: https://datasheet.ciiva.com/7850/1018594-7850022.pdf?src-supplier=Element14; ComponentLink2Description: https://datasheet.ciiva.com/7850/1018594-7850022.pdf?src-supplier=Element14; ComponentLink3URL: https://datasheet.ciiva.com/7850/1018594-7850023.pdf?src-supplier=Element14; ComponentLink3Description: https://datasheet.ciiva.com/7850/1018594-7850023.pdf?src-supplier=Element14; ComponentLink4URL: https://datasheet.ciiva.com/15215/getdatasheetpartid-328119-15215035.pdf?src-supplier=Verical; ComponentLink4Description: https://datasheet.ciiva.com/15215/getdatasheetpartid-328119-15215035.pdf?src-supplier=Verical; Supplier Part Number 1: 311-4.7KLRCT-ND; LCSC Part Number: C105871
R?#9 R?#10 R?#12 R?#13 = AC0402FR-075K1L: RES SMD 5.1K OHM 1% 1/16W 0402; Manufacturer: Yageo; Resistance: 5.1kR; Power Rating: 63mW; Temperature Coefficient: 100ppm/°C; Voltage Rating: 50V; Supplier 1: Digikey; Manufacturer Part Number: AC0402FR-075K1L; RoHS: Yes; Category: Chip SMD Resistors; Stock 1: 83902; Pricing 1: 1=0.1, 10=0.019, 50=0.0116, 100=0.0095, 500=0.00638, 1000=0.00544, 5000=0.00391 (USD); Mount: Surface Mount; Case/Package: 0402; Case Code (Metric): 1005; Case Code (Imperial): 0402; Size Code: 0402; Min Operating Temperature: -55°C; Max Operating Temperature: 155°C; Tolerance: 1%; Packaging: Cut Tape; Number of Terminations: 2; Max Power Dissipation: 63mW; Features: Moisture Resistant,Automotive AEC-Q200; Series: AC; Length: 0.039inch; Width: 0.02inch; Height: 0.015inch; Lead Free: Lead Free; RoHS Compliant: Yes; ComponentLink1URL: http://www.yageo.com/NewPortal/yageodocoutput?fileName=/pdf/R-Chip/PYu-AC_51_RoHS_L_6.pdf&src-supplier=Digikey; ComponentLink1Description: http://www.yageo.com/NewPortal/yageodocoutput?fileName=/pdf/R-Chip/PYu-AC_51_RoHS_L_6.pdf&src-supplier=Digikey; ComponentLink2URL: http://www.yageo.com/documents/recent/PYu-AC_51_RoHS_L_2_revised.pdf?src-supplier=Future+Electronics; ComponentLink2Description: http://www.yageo.com/documents/recent/PYu-AC_51_RoHS_L_2_revised.pdf?src-supplier=Future+Electronics; ComponentLink3URL: https://datasheet.octopart.com/AC0402FR-075K1L-Yageo-datasheet-166720450.pdf?src-supplier=Future+Electronics; ComponentLink3Description: https://datasheet.octopart.com/AC0402FR-075K1L-Yageo-datasheet-166720450.pdf?src-supplier=Future+Electronics; Supplier Part Number 1: YAG3503CT-ND; LCSC Part Number: C144745
SW?#1 SW?#2 = PTS645SH50SMTR92LFS: SWITCH TACTILE SPST-NO 0.05A 12V; Manufacturer: ITT C&K; Contact Current Rating: 50mA; Contact Resistance: 100mR; Number of Positions: 2NUMBER; Supplier 1: Digikey; Manufacturer Part Number: PTS645SH50SMTR92LFS; RoHS: Yes; Category: Tactile Switches; Stock 1: 49323; Pricing 1: 1=0.35, 10=0.337, 25=0.3172, 100=0.2753, 250=0.24972, 500=0.2323 (USD); Lead Free: 5697LeadFree; ComponentLink1URL: https://datasheet.ciiva.com/29903/getdatasheetpartid-773702-29903807.pdf?src-supplier=Verical; ComponentLink1Description: https://datasheet.ciiva.com/29903/getdatasheetpartid-773702-29903807.pdf?src-supplier=Verical; ComponentLink2URL: https://datasheet.ciiva.com/14920/pts645-14920741.pdf?src-supplier=Digikey; ComponentLink2Description: https://datasheet.ciiva.com/14920/pts645-14920741.pdf?src-supplier=Digikey; ComponentLink3URL: https://datasheet.ciiva.com/22637/1707731-22637356.pdf?src-supplier=Element14; ComponentLink3Description: https://datasheet.ciiva.com/22637/1707731-22637356.pdf?src-supplier=Element14; Supplier Part Number 1: CKN9085CT-ND; LCSC Part Number: C221869
U?#1 = FT231XQ-R: IC USB SERIAL FULL UART 20QFN; Manufacturer: FTDI; Supplier 1: Digikey; Manufacturer Part Number: FT231XQ-R; RoHS: Yes; Category: Interface ICs; Stock 1: 67655; Pricing 1: 1=2.34, 25=2.27, 100=2.2, 250=2, 500=1.82002, 1000=1.7625, 5000=1.7625 (USD); Height: 800um; Lead Free: 5697LeadFree; ComponentLink1URL: https://datasheet.ciiva.com/4787/ds-ft231x-13571-4787570.pdf?src-supplier=Mouser; ComponentLink1Description: https://datasheet.ciiva.com/4787/ds-ft231x-13571-4787570.pdf?src-supplier=Mouser; ComponentLink2URL: https://datasheet.ciiva.com/30475/0900766b811020d3-30475405.pdf?src-supplier=Rs; ComponentLink2Description: https://datasheet.ciiva.com/30475/0900766b811020d3-30475405.pdf?src-supplier=Rs; ComponentLink3URL: https://datasheet.ciiva.com/1787/ds-ft231x-1787312.pdf?src-supplier=Digikey; ComponentLink3Description: https://datasheet.ciiva.com/1787/ds-ft231x-1787312.pdf?src-supplier=Digikey; ComponentLink4URL: https://datasheet.ciiva.com/1787/ft-x-series-1787313.pdf?src-supplier=Digikey; ComponentLink4Description: https://datasheet.ciiva.com/1787/ft-x-series-1787313.pdf?src-supplier=Digikey; ComponentLink5URL: https://datasheet.ciiva.com/1787/ft-x-series-1787314.pdf?src-supplier=Digikey; ComponentLink5Description: https://datasheet.ciiva.com/1787/ft-x-series-1787314.pdf?src-supplier=Digikey; Supplier Part Number 1: 768-1128-1-ND; LCSC Part Number: C132159
U?#2 = TL1963A-33DCYR: IC REG LINEAR 3.3V 1.5A SOT223-4; Manufacturer: Texas Instruments; Supplier 1: Digikey; Manufacturer Part Number: TL1963A-33DCYR; RoHS: Yes; Category: Voltage Regulators - Linear; Stock 1: 2796; Pricing 1: 1=2.87, 10=2.578, 25=2.4368, 100=2.112, 250=2.00368, 500=1.79788, 1000=1.51629 (USD); Thickness: 1.6mm; Lead Free: 5697LeadFree; ComponentLink1URL: https://datasheet.ciiva.com/2046/-2046068.pdf?src-supplier=Digikey; ComponentLink1Description: https://datasheet.ciiva.com/2046/-2046068.pdf?src-supplier=Digikey; Supplier Part Number 1: 296-24897-1-ND; LCSC Part Number: C181262
U?#3 = ESP32-S3-MINI-1-N8: SMD module, ESP32-S3FN8, 8 MB SPI flash, PCB antenna; Manufacturer: Espressif Systems; Supplier 1: Digikey; Manufacturer Part Number: ESP32-S3-MINI-1-N8; RoHS: No; Category: LDO; Stock 1: 18725; Pricing 1: 1=3.1 (USD); ComponentLink1URL: https://datasheet.octopart.com/ESP32-S3-MINI-1-N8-Espressif-Systems-datasheet-165560562.pdf?src-supplier=TME; ComponentLink1Description: https://datasheet.octopart.com/ESP32-S3-MINI-1-N8-Espressif-Systems-datasheet-165560562.pdf?src-supplier=TME; Supplier Part Number 1: 1965-ESP32-S3-MINI-1-N8CT-ND; LCSC Part Number: C2913206